# Altium schematic sheet DAC_ADC_External.SchDoc: BluetoothGateway
size A; DrawnBy: Q.Thang & T.Khoa; Revision: V1.0.0; SheetNumber: 15; SheetTotal: 17
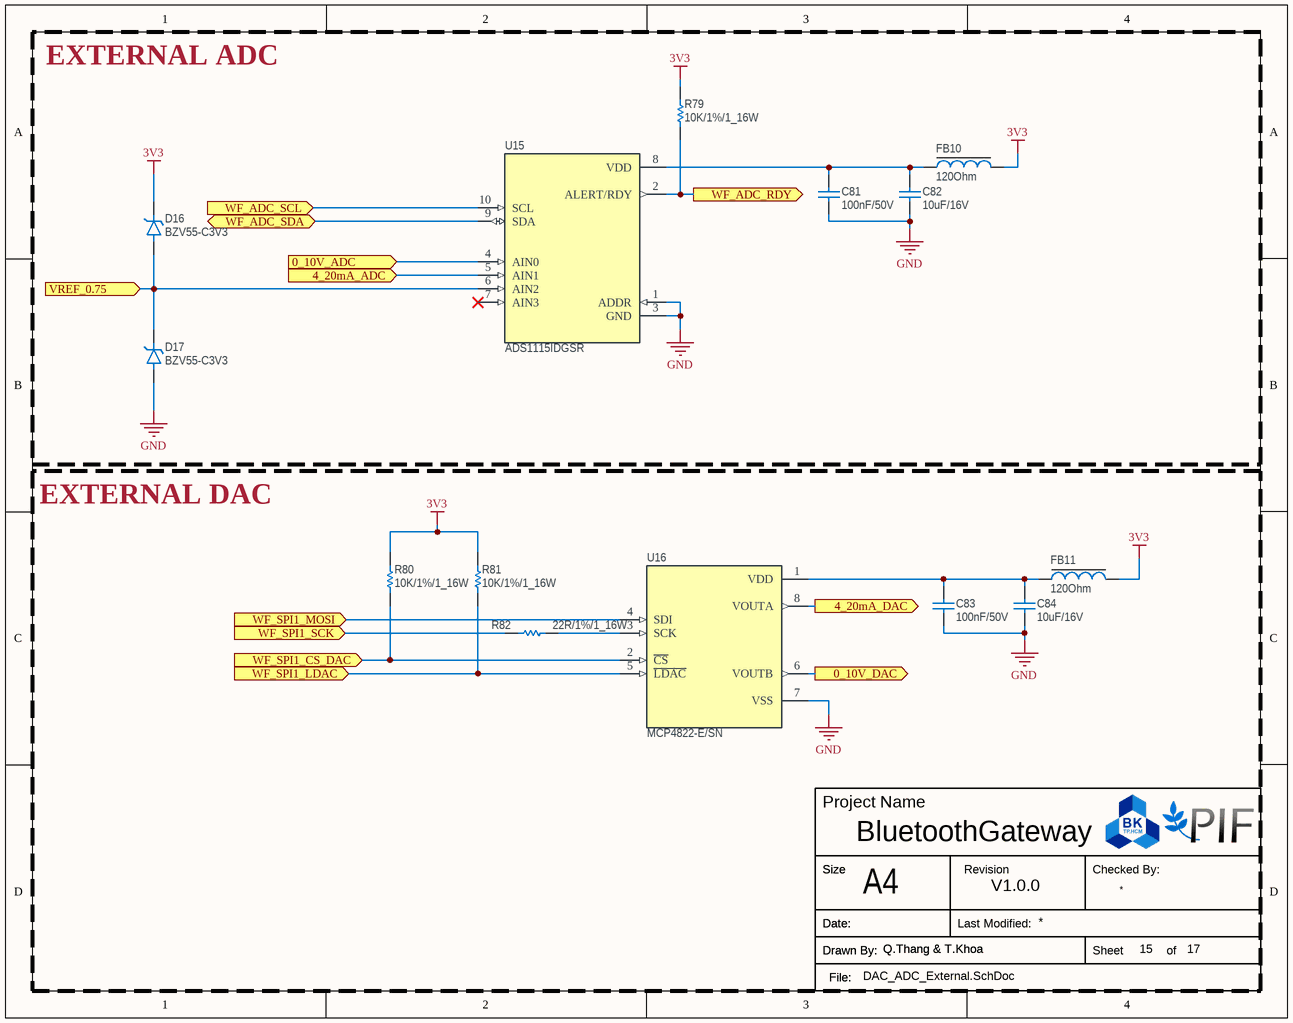
[diagram p0: DAC_ADC_External.SchDoc]

## Parts
C81  100nF/50V  [CAP_0603]
C82  10uF/16V  [CAP_0603]
C83  100nF/50V  [CAP_0603]
C84  10uF/16V  [CAP_0603]
D16  BZV55-C3V3  [SOD-80]
D17  BZV55-C3V3  [SOD-80]
FB10  120Ohm  [Ferrite_Bead_0805]
FB11  120Ohm  [Ferrite_Bead_0805]
R79  10K/1%/1_16W  [RESISTOR_0402]
R80  10K/1%/1_16W  [RESISTOR_0402]
R81  10K/1%/1_16W  [RESISTOR_0402]
R82  22R/1%/1_16W  [RESISTOR_0402]
U15  ADS1115IDGSR  [VSSOP-10]
U16  MCP4822-E/SN  [SOIC-8]

## Blocks framed on the sheet
EXTERNAL ADC: C81 C82 D16 D17 FB10 R79 U15
EXTERNAL DAC: C83 C84 FB11 R80-R82 U16

## Ports
0_10V_ADC (in, see Overview_Schematic[6C], 0-10V_Converter[4A]), 0_10V_DAC (out, see Overview_Schematic[6C], 0-10V_Converter[1C]), 4_20mA_ADC (in, see Overview_Schematic[6C], 4-20mA_Converter[6C]), 4_20mA_DAC (out, see Overview_Schematic[6C], 4-20mA_Converter[1B]), VREF_0.75 (in, see Overview_Schematic[6C], 4-20mA_Converter[6A]), WF_ADC_RDY (out, see Overview_Schematic[6C], ESP32_WiFi[3B]), WF_ADC_SCL (in, see Overview_Schematic[6C], ESP32_WiFi[3B]), WF_ADC_SDA (bidir, see Overview_Schematic[6C], ESP32_WiFi[3B]), WF_SPI1_CS_DAC (in, see Overview_Schematic[5C], ESP32_WiFi[2B]), WF_SPI1_LDAC (in, see Overview_Schematic[5C], ESP32_WiFi[2B]), WF_SPI1_MOSI (in, see Overview_Schematic[5C], Display[2C], ESP32_WiFi[2B]), WF_SPI1_SCK (in, see Overview_Schematic[5C], Display[2C], ESP32_WiFi[2B])

## Nets
3V3: D16.C FB10.2 FB11.2 R79.2 R80.2 R81.2
GND: C81.1 C82.1 C83.1 C84.1 D17.A U15.1(ADDR) U15.3(GND) U16.7(VSS)
0_10V_ADC: U15.4(AIN0) ; port 0_10V_ADC
0_10V_DAC: U16.6(VOUTB) ; port 0_10V_DAC
4_20mA_ADC: U15.5(AIN1) ; port 4_20mA_ADC
4_20mA_DAC: U16.8(VOUTA) ; port 4_20mA_DAC
VREF_0.75: D16.A D17.C U15.6(AIN2) ; port VREF_0.75
WF_ADC_RDY: R79.1 U15.2(ALERT/RDY) ; port WF_ADC_RDY
WF_ADC_SCL: U15.10(SCL) ; port WF_ADC_SCL
WF_ADC_SDA: U15.9(SDA) ; port WF_ADC_SDA
WF_SPI1_CS_DAC: R80.1 U16.2(~{CS}) ; port WF_SPI1_CS_DAC
WF_SPI1_LDAC: R81.1 U16.5(~{LDAC}) ; port WF_SPI1_LDAC
WF_SPI1_MOSI: U16.4(SDI) ; port WF_SPI1_MOSI
WF_SPI1_SCK: R82.1 ; port WF_SPI1_SCK
NetC81_2: C81.2 C82.2 FB10.1 U15.8(VDD)
NetC83_2: C83.2 C84.2 FB11.1 U16.1(VDD)
NetR82_2: R82.2 U16.3(SCK)

Not connected (* = marked no-connect by the designer): U15 7(AIN3)*

## Notes on the sheet
- Project Name
- Size
- A4
- Revision
- Checked By:
- Drawn By:
- Date:
- File:
- Last Modified:
- Sheet
- of

## Library data of the parts
C81 C83 = Ceramic_Cap_100nF_50V_0603: CAP, size 0603, 100nF, 50V; Supply Part Number: Tụ Gốm 0603 100nF (0.1uF) 50V; Supply Name: Thegioiic; Datasheet: *; Supply URL: https://www.thegioiic.com/tu-gom-0603-100nf-0-1uf-50v
C82 C84 = Ceramic_Cap_10uF_16V_0603: CAP, size 0603, 10uF, 16V; Supply Part Number: Tụ Gốm 0603 10uF 16V; Supply Name: Thegioiic; Datasheet: *; Supply URL: https://www.thegioiic.com/tu-gom-0603-10uf-16v
D16 D17 = Diode_BZV55C3V3: DIODE ZENER 3.3V 500 mW; Supply Name: tme; Datasheet: https://www.alldatasheet.com/datasheet-pdf/view/17578/PHILIPS/BZV55.html; Supply Part Number: BZV55-C3V3; Supply URL: http://www.tme.vn/Product.aspx?id=1871#page=pro_info
FB10 FB11 = Ferrite_Bead_120Ohm_2A_0805: Ferrite Bead, size 0805, 120Ohm, 2A; Supply Part Number: CBW201209U121T Ferrite Beads 2A 120 Ohm 0805; Supply Name: Thegioiic; Supply URL: https://www.thegioiic.com/cbw201209u121t-ferrite-beads-2a-120-ohm-0805
R79-R81 = Res_10K_0402_1%: Resistor 0402 10KOhm 1% 1_16W; Supply Part Number: Điện Trở 10 KOhm 0402 1%; Supply Name: Thegioiic; Supply URL: https://www.thegioiic.com/dien-tro-10-kohm-0402-1-
R82 = Res_22R_0402_1%: Resistor 0402 22 Ohm 1% 1_16W; Supply Name: *; Supply Part Number: *; Supply URL: *
U15 = ADS1115IDGSR: Supply Part Number: ADS1115IDGSR IC ADC 16-Bit Sigma-Delta 10-VSSOP; Supply Name: Thegioiic; Datasheet: https://www.ti.com/lit/ds/symlink/ads1114.pdf?ts=1737360738578&ref_url=https%253A%252F%252Fwww.google.com%252F; Supply URL: https://www.thegioiic.com/ads1115idgsr-ic-adc-16-bit-sigma-delta-10-vssop
U16 = MCP4822-E/SN: 12 Bit Digital to Analog Converter 2 8-SOIC; Supply Part Number: MCP4822-E/SN SOIC-8 DAC 12Bit Chính Hãng Microchip; Supply Name: BanLinhKien; Datasheet: https://ww1.microchip.com/downloads/aemDocuments/documents/OTH/ProductDocuments/DataSheets/20002249B.pdf; Supply URL: https://banlinhkien.com/m4822esn-soic8-dac-12bit-chinh-hang-microchip-p6651182.html